# EasyEDA schematic Sheet_2.json
TITLE: Sheet_2; REV: 1.0; Date: 2024-06-06; Sheet: 1/1; Drawn By: ansumansahu77209; Company: Your Company
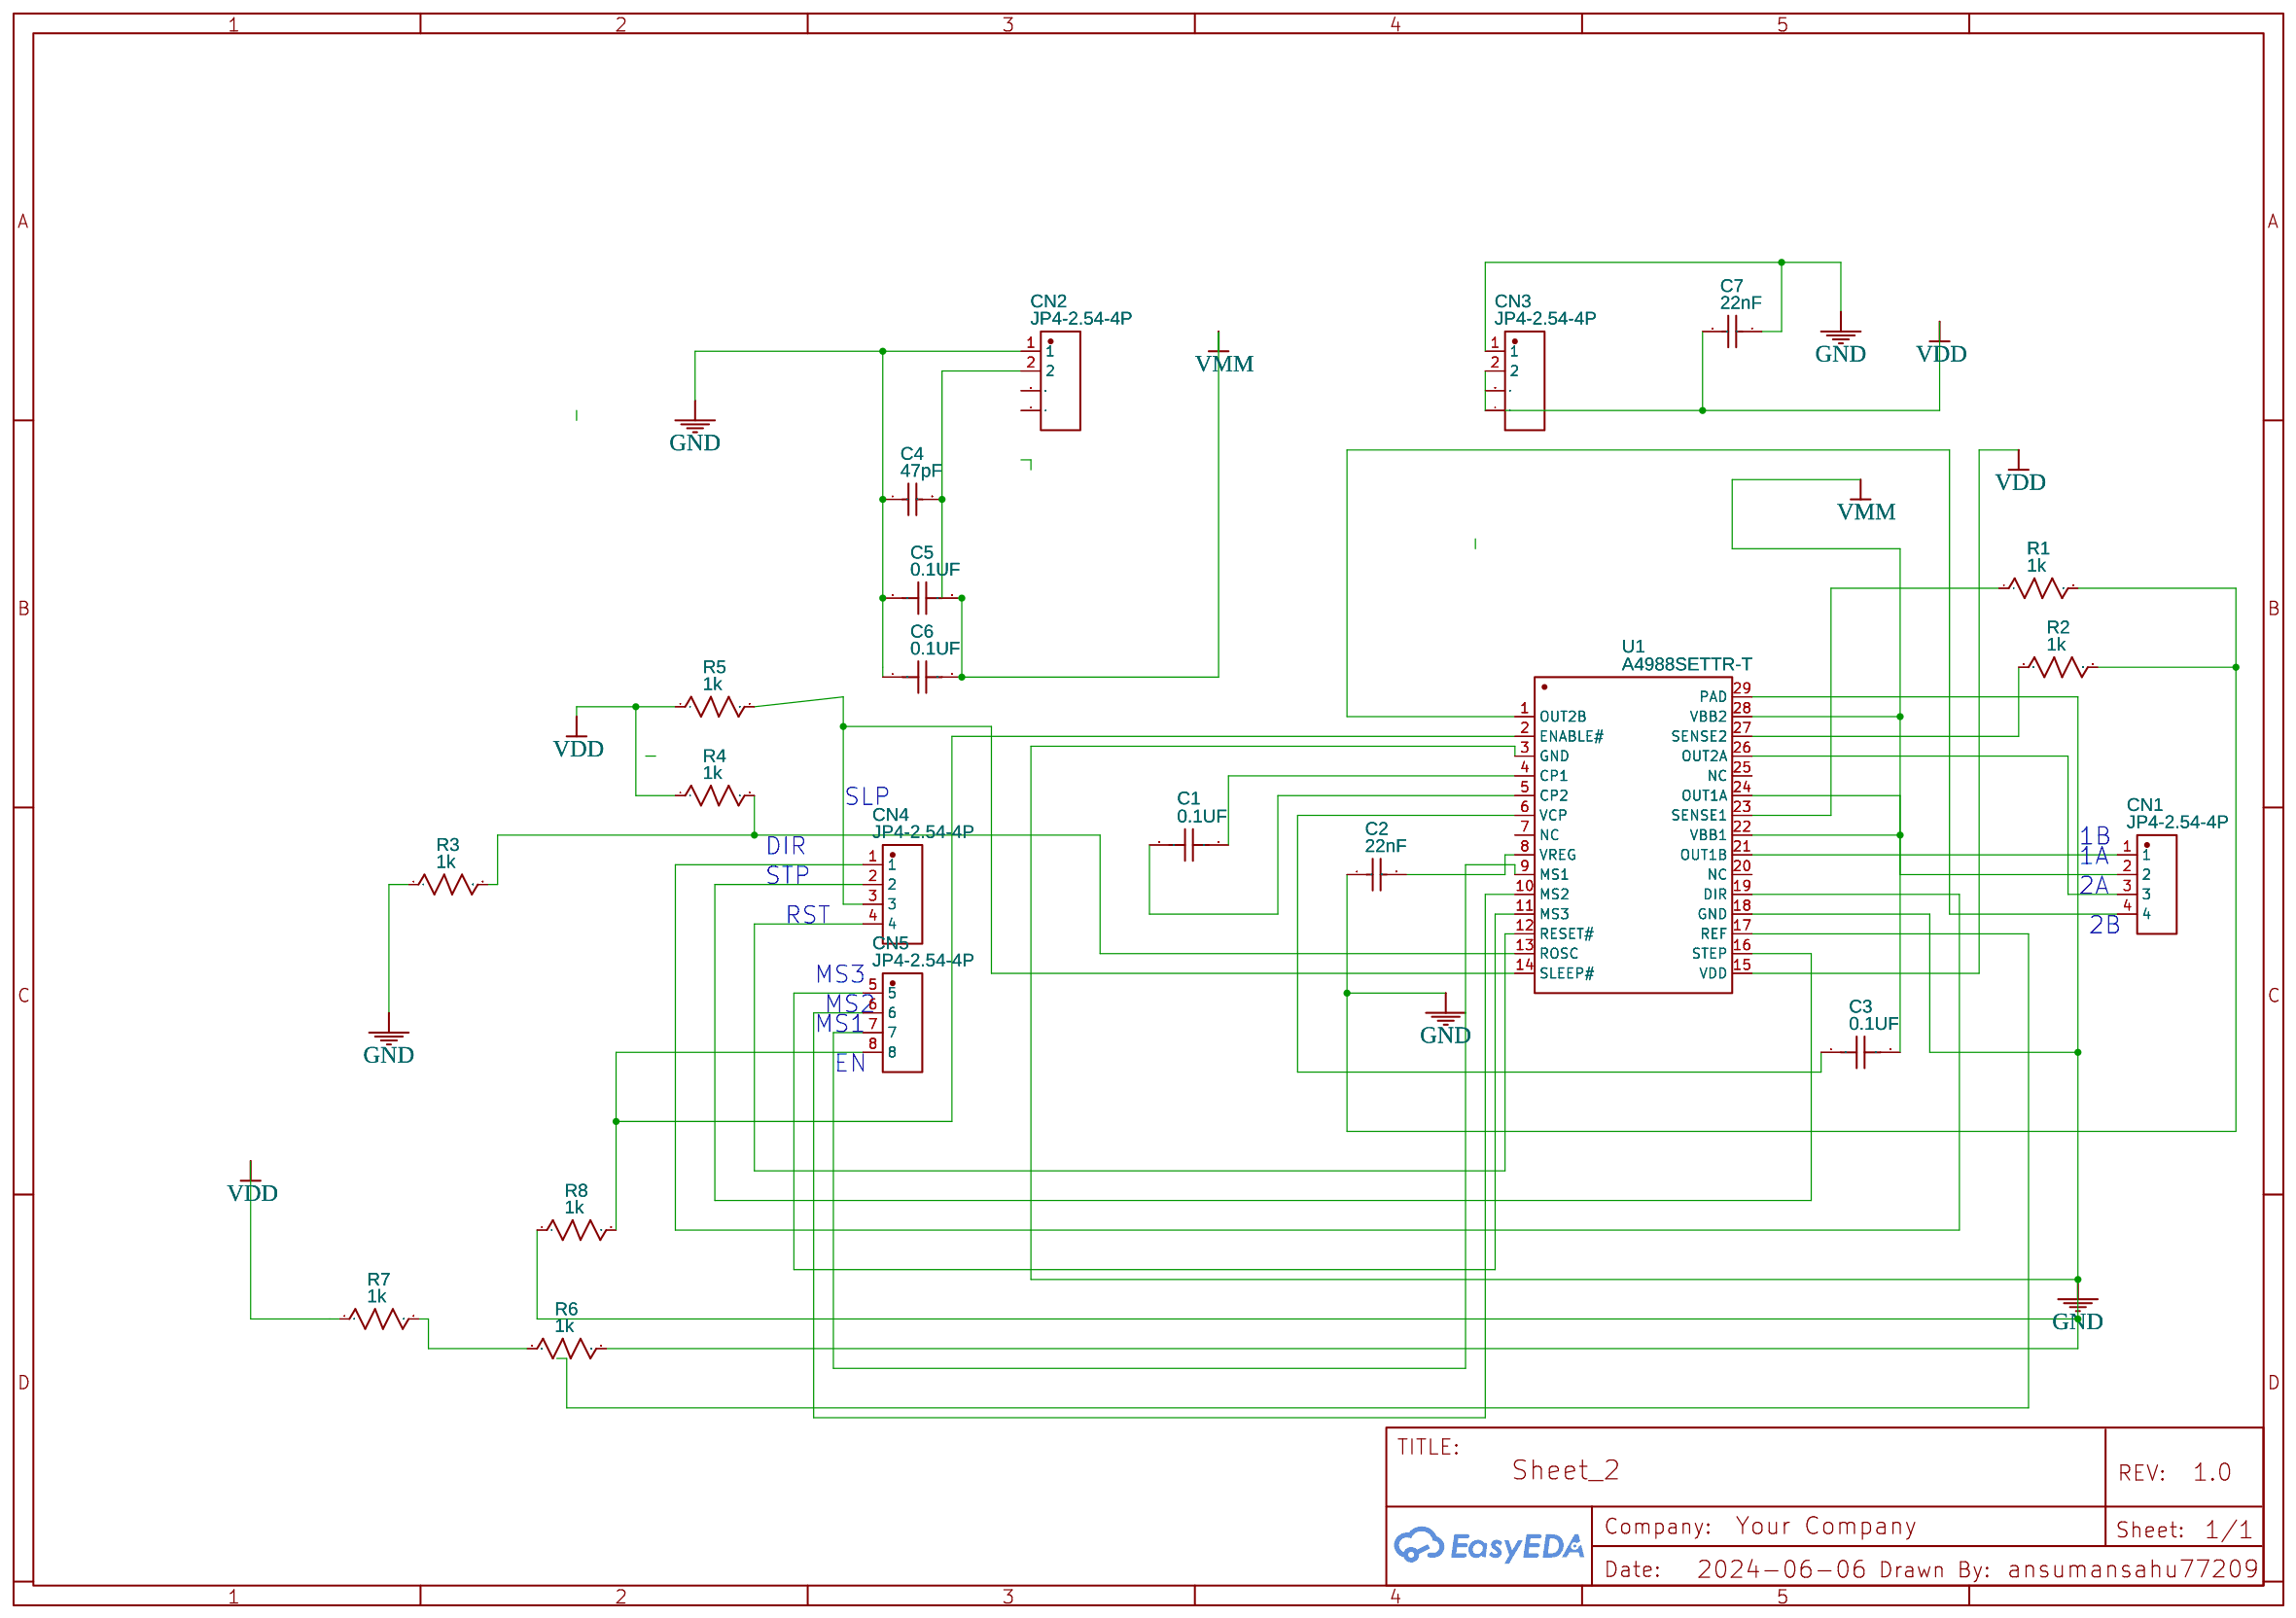
[diagram p0: schematic sheet]

## Parts
C1  0.1UF  [CAP-TH_L10.0-W4.5-P7.50-D0.6]
C2  22nF  [CAP-TH_L7.0-W3.5-P5.00-D0.6]
C3  0.1UF  [CAP-TH_L10.0-W4.5-P7.50-D0.6]
C4  47pF  [CAP-TH_L5.0-W4.0-P5.00-D1.0]
C5  0.1UF  [CAP-TH_L10.0-W4.5-P7.50-D0.6]
C6  0.1UF  [CAP-TH_L10.0-W4.5-P7.50-D0.6]
C7  22nF  [CAP-TH_L7.0-W3.5-P5.00-D0.6]
CN1  JP4-2.54-4P  [CONN-TH_4P-P2.54_JP4-2.54-4P]
CN2  JP4-2.54-4P  [CONN-TH_4P-P2.54_JP4-2.54-4P]
CN3  JP4-2.54-4P  [CONN-TH_4P-P2.54_JP4-2.54-4P]
CN4  JP4-2.54-4P  [CONN-TH_4P-P2.54_JP4-2.54-4P]
CN5  JP4-2.54-4P  [CONN-TH_4P-P2.54_JP4-2.54-4P]
R1  1k  [R0603]
R2  1k  [R0603]
R3  1k  [R0603]
R4  1k  [R0603]
R5  1k  [R0603]
R6  1k  [R0603]
R7  1k  [R0603]
R8  1k  [R0603]
U1  A4988SETTR-T  [WQFN-28_L5.0-W5.0-P0.50-BL-EP3.2]

## Library data of the parts
C1 C3 C5 C6 = 250V 0.1UF 5% CBBCapacitor: Supplier: LCSC; Manufacturer: ReliaPro; Supplier Part: C46804; JLCPCB Part Class: Extended Part
C2 C7 = Calibration capacitor22NF（223） 100V 5%: Supplier: LCSC; Manufacturer: ReliaPro; Supplier Part: C26612; JLCPCB Part Class: Extended Part
C4 = Ceramic capacitors47PF 3KV: Supplier: LCSC; Manufacturer: null; Manufacturer Part: 瓷片电容47PF 3KV; Supplier Part: C19375; JLCPCB Part Class: Extended Part
CN1 = JP4-2.54-4P: Contributor: LCSC; Supplier: LCSC; Supplier Part: C9900001745; JLCPCB Part Class: Extended Part
CN2-CN5 = JP4-2.54-4P: Contributor: LCSC; Supplier: LCSC; Supplier Part: C9900001745; JLCPCB Part Class: Extended Part; Package Display: No
R1-R8 = R_0603_US: Contributor: LCEDA_Lib
U1 = A4988SETTR-T: Supplier: LCSC; Manufacturer: ALLEGRO(美国埃戈罗); Supplier Part: C38437; JLCPCB Part Class: Extended Part

## Nets
GND: C2.1 C4.1 C5.1 C6.1 C7.2 CN2.1 CN3.1 R1.2 R2.2 R3.1 R6.2 R8.1 U1.3(GND) U1.18(GND) U1.29(PAD)
VDD: C7.1 CN3.2 CN3.4 R4.1 R5.1 R7.1 U1.15(VDD)
VMM: C3.2 C4.2 C5.2 C6.2 CN1.2 CN2.2 U1.22(VBB1) U1.24(OUT1A) U1.28(VBB2)
Net-(C1-1): C1.1 U1.5(CP2)
Net-(C1-2): C1.2 U1.4(CP1)
Net-(C2-2): C2.2 U1.8(VREG)
Net-(C3-1): C3.1 U1.6(VCP)
Net-(CN1-1): CN1.1 U1.21(OUT1B)
Net-(CN1-3): CN1.3 U1.26(OUT2A)
Net-(CN1-4): CN1.4 U1.1(OUT2B)
Net-(CN4-1): CN4.1 U1.19(DIR)
Net-(CN4-2): CN4.2 U1.16(STEP)
Net-(CN4-3): CN4.3 R5.2 U1.14(SLEEP#)
Net-(CN4-4): CN4.4 U1.12(RESET#)
Net-(CN5-5): CN5.5 U1.11(MS3)
Net-(CN5-6): CN5.6 U1.10(MS2)
Net-(CN5-7): CN5.7 U1.9(MS1)
Net-(CN5-8): CN5.8 R8.2 U1.2(ENABLE#)
Net-(R1-1): R1.1 U1.23(SENSE1)
Net-(R2-1): R2.1 U1.27(SENSE2)
Net-(R3-2): R3.2 R4.2 U1.13(ROSC)
Net-(R6-1): R6.1 R7.2

Not connected (* = marked no-connect by the designer): CN2 3 4; CN3 3; U1 7(NC) 17(REF) 20(NC) 25(NC)

## Notes on the sheet
- SLP
- DIR
- 1B
- 1A
- STP
- 2A
- RST
- 2B
- MS3
- MS2
- MS1
- EN
